# Altium schematic sheet MB1364_Top.SchDoc: mb1319 Top: hierarchical view
size A4; Date: Not used; ApprovedBy: Not used; CheckedBy: Not used; Author: Not used; CompanyName: STMicroelectronics; DrawnBy: Not used; Engineer: Not used; Organization: Not used; Address1: Not used; Address2: Not used; Address3: Not used; Address4: Not used; DocumentNumber: 2; Revision: Not used; SheetNumber: 2; SheetTotal: 9; CurrentTime: Not used; CurrentDate: Not used; Time: Not used; DocumentFullPathAndName: Not used; DocumentName: Not used; ModifiedDate: Not used; ImagePath: Not used; ProjectName: Not used; Application_BuildNumber: Not used
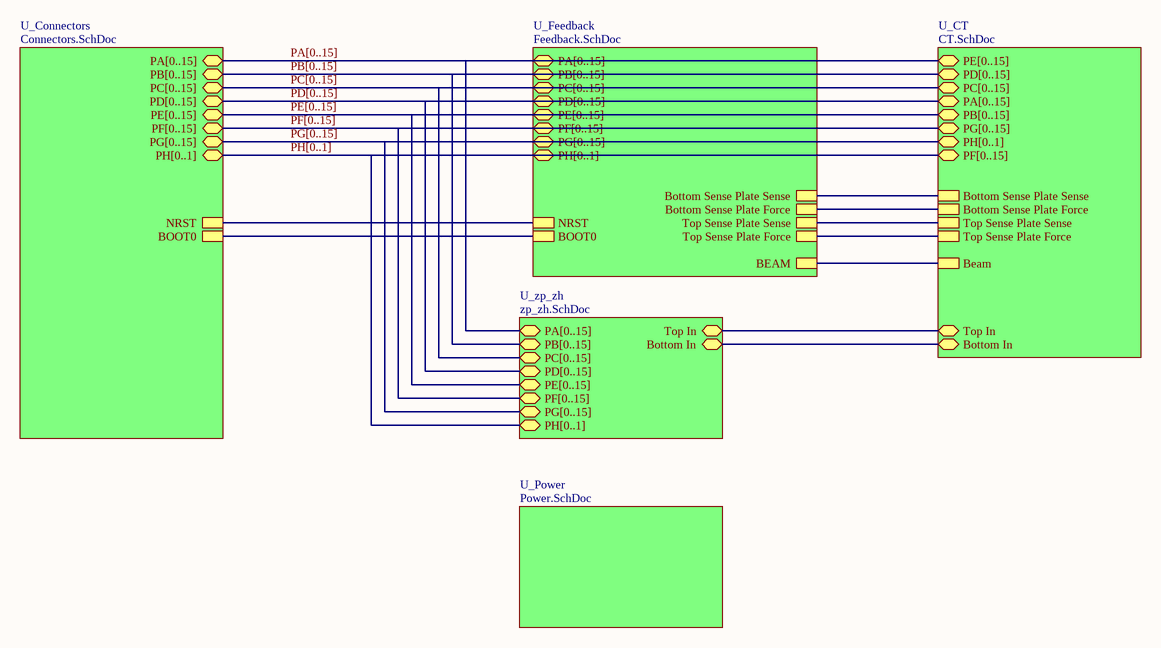
[diagram p0: MB1364_Top.SchDoc]

## Sub-sheets
U_Connectors = Connectors.SchDoc: PA[0..15] (bidir), PB[0..15] (bidir), PC[0..15] (bidir), PD[0..15] (bidir), PE[0..15] (bidir), PH[0..1] (bidir), NRST, BOOT0, PF[0..15] (bidir), PG[0..15] (bidir)
U_CT = CT.SchDoc: Beam, Top Sense Plate Force, Top Sense Plate Sense, Bottom Sense Plate Force, Bottom Sense Plate Sense, Top In (bidir), Bottom In (bidir), PE[0..15] (bidir), PD[0..15] (bidir), PC[0..15] (bidir), PA[0..15] (bidir), PB[0..15] (bidir), PG[0..15] (bidir), PH[0..1] (bidir), PF[0..15] (bidir)
U_Feedback = Feedback.SchDoc: Top Sense Plate Force, Top Sense Plate Sense, Bottom Sense Plate Force, Bottom Sense Plate Sense, BEAM, NRST, BOOT0, PA[0..15] (bidir), PB[0..15] (bidir), PC[0..15] (bidir), PD[0..15] (bidir), PE[0..15] (bidir), PF[0..15] (bidir), PG[0..15] (bidir), PH[0..1] (bidir)
U_Power = Power.SchDoc: no entries
U_zp_zh = zp_zh.SchDoc: PA[0..15] (bidir), PB[0..15] (bidir), PC[0..15] (bidir), PD[0..15] (bidir), PE[0..15] (bidir), PF[0..15] (bidir), PG[0..15] (bidir), PH[0..1] (bidir), Bottom In (bidir), Top In (bidir)

## Nets
(unnamed): sheet U_Connectors/NRST, sheet U_Feedback/NRST
(unnamed): sheet U_Connectors/BOOT0, sheet U_Feedback/BOOT0
(unnamed): sheet U_CT/Beam, sheet U_Feedback/BEAM
(unnamed): sheet U_CT/Top Sense Plate Force, sheet U_Feedback/Top Sense Plate Force
(unnamed): sheet U_CT/Top Sense Plate Sense, sheet U_Feedback/Top Sense Plate Sense
(unnamed): sheet U_CT/Bottom Sense Plate Force, sheet U_Feedback/Bottom Sense Plate Force
(unnamed): sheet U_CT/Bottom Sense Plate Sense, sheet U_Feedback/Bottom Sense Plate Sense
(unnamed): sheet U_CT/Top In, sheet U_zp_zh/Top In
(unnamed): sheet U_CT/Bottom In, sheet U_zp_zh/Bottom In

## Buses and harness runs
bus PA[0..15] = PB[0..15] = PC[0..15] = PD[0..15] = PE[0..15] = PF[0..15] = PG[0..15] = PH[0..1] = sheet U_Connectors/PA[0..15] = sheet U_Connectors/PB[0..15] = sheet U_Connectors/PC[0..15] = sheet U_Connectors/PD[0..15] = sheet U_Connectors/PE[0..15] = sheet U_Connectors/PF[0..15] = sheet U_Connectors/PG[0..15] = sheet U_Connectors/PH[0..1] = sheet U_CT/PA[0..15] = sheet U_CT/PB[0..15] = sheet U_CT/PC[0..15] = sheet U_CT/PD[0..15] = sheet U_CT/PE[0..15] = sheet U_CT/PF[0..15] = sheet U_CT/PG[0..15] = sheet U_CT/PH[0..1] = sheet U_Feedback/PA[0..15] = sheet U_Feedback/PB[0..15] = sheet U_Feedback/PC[0..15] = sheet U_Feedback/PD[0..15] = sheet U_Feedback/PE[0..15] = sheet U_Feedback/PF[0..15] = sheet U_Feedback/PG[0..15] = sheet U_Feedback/PH[0..1] = sheet U_zp_zh/PA[0..15] = sheet U_zp_zh/PB[0..15] = sheet U_zp_zh/PC[0..15] = sheet U_zp_zh/PD[0..15] = sheet U_zp_zh/PE[0..15] = sheet U_zp_zh/PF[0..15] = sheet U_zp_zh/PG[0..15] = sheet U_zp_zh/PH[0..1]

## Notes on the sheet
- Title:
- Project:
- Size:
- Revision:
- Variant:
- A4
- -
- Date:
- Reference:
- Sheet:
- of